# EasyEDA schematic SCH_可乐充电宝_2022-09-24.json
TITLE: Sheet_1; REV: 1.0; Date: 2022-09-20; Sheet: 1/1; Drawn By: big_big_A; Company: Your Company
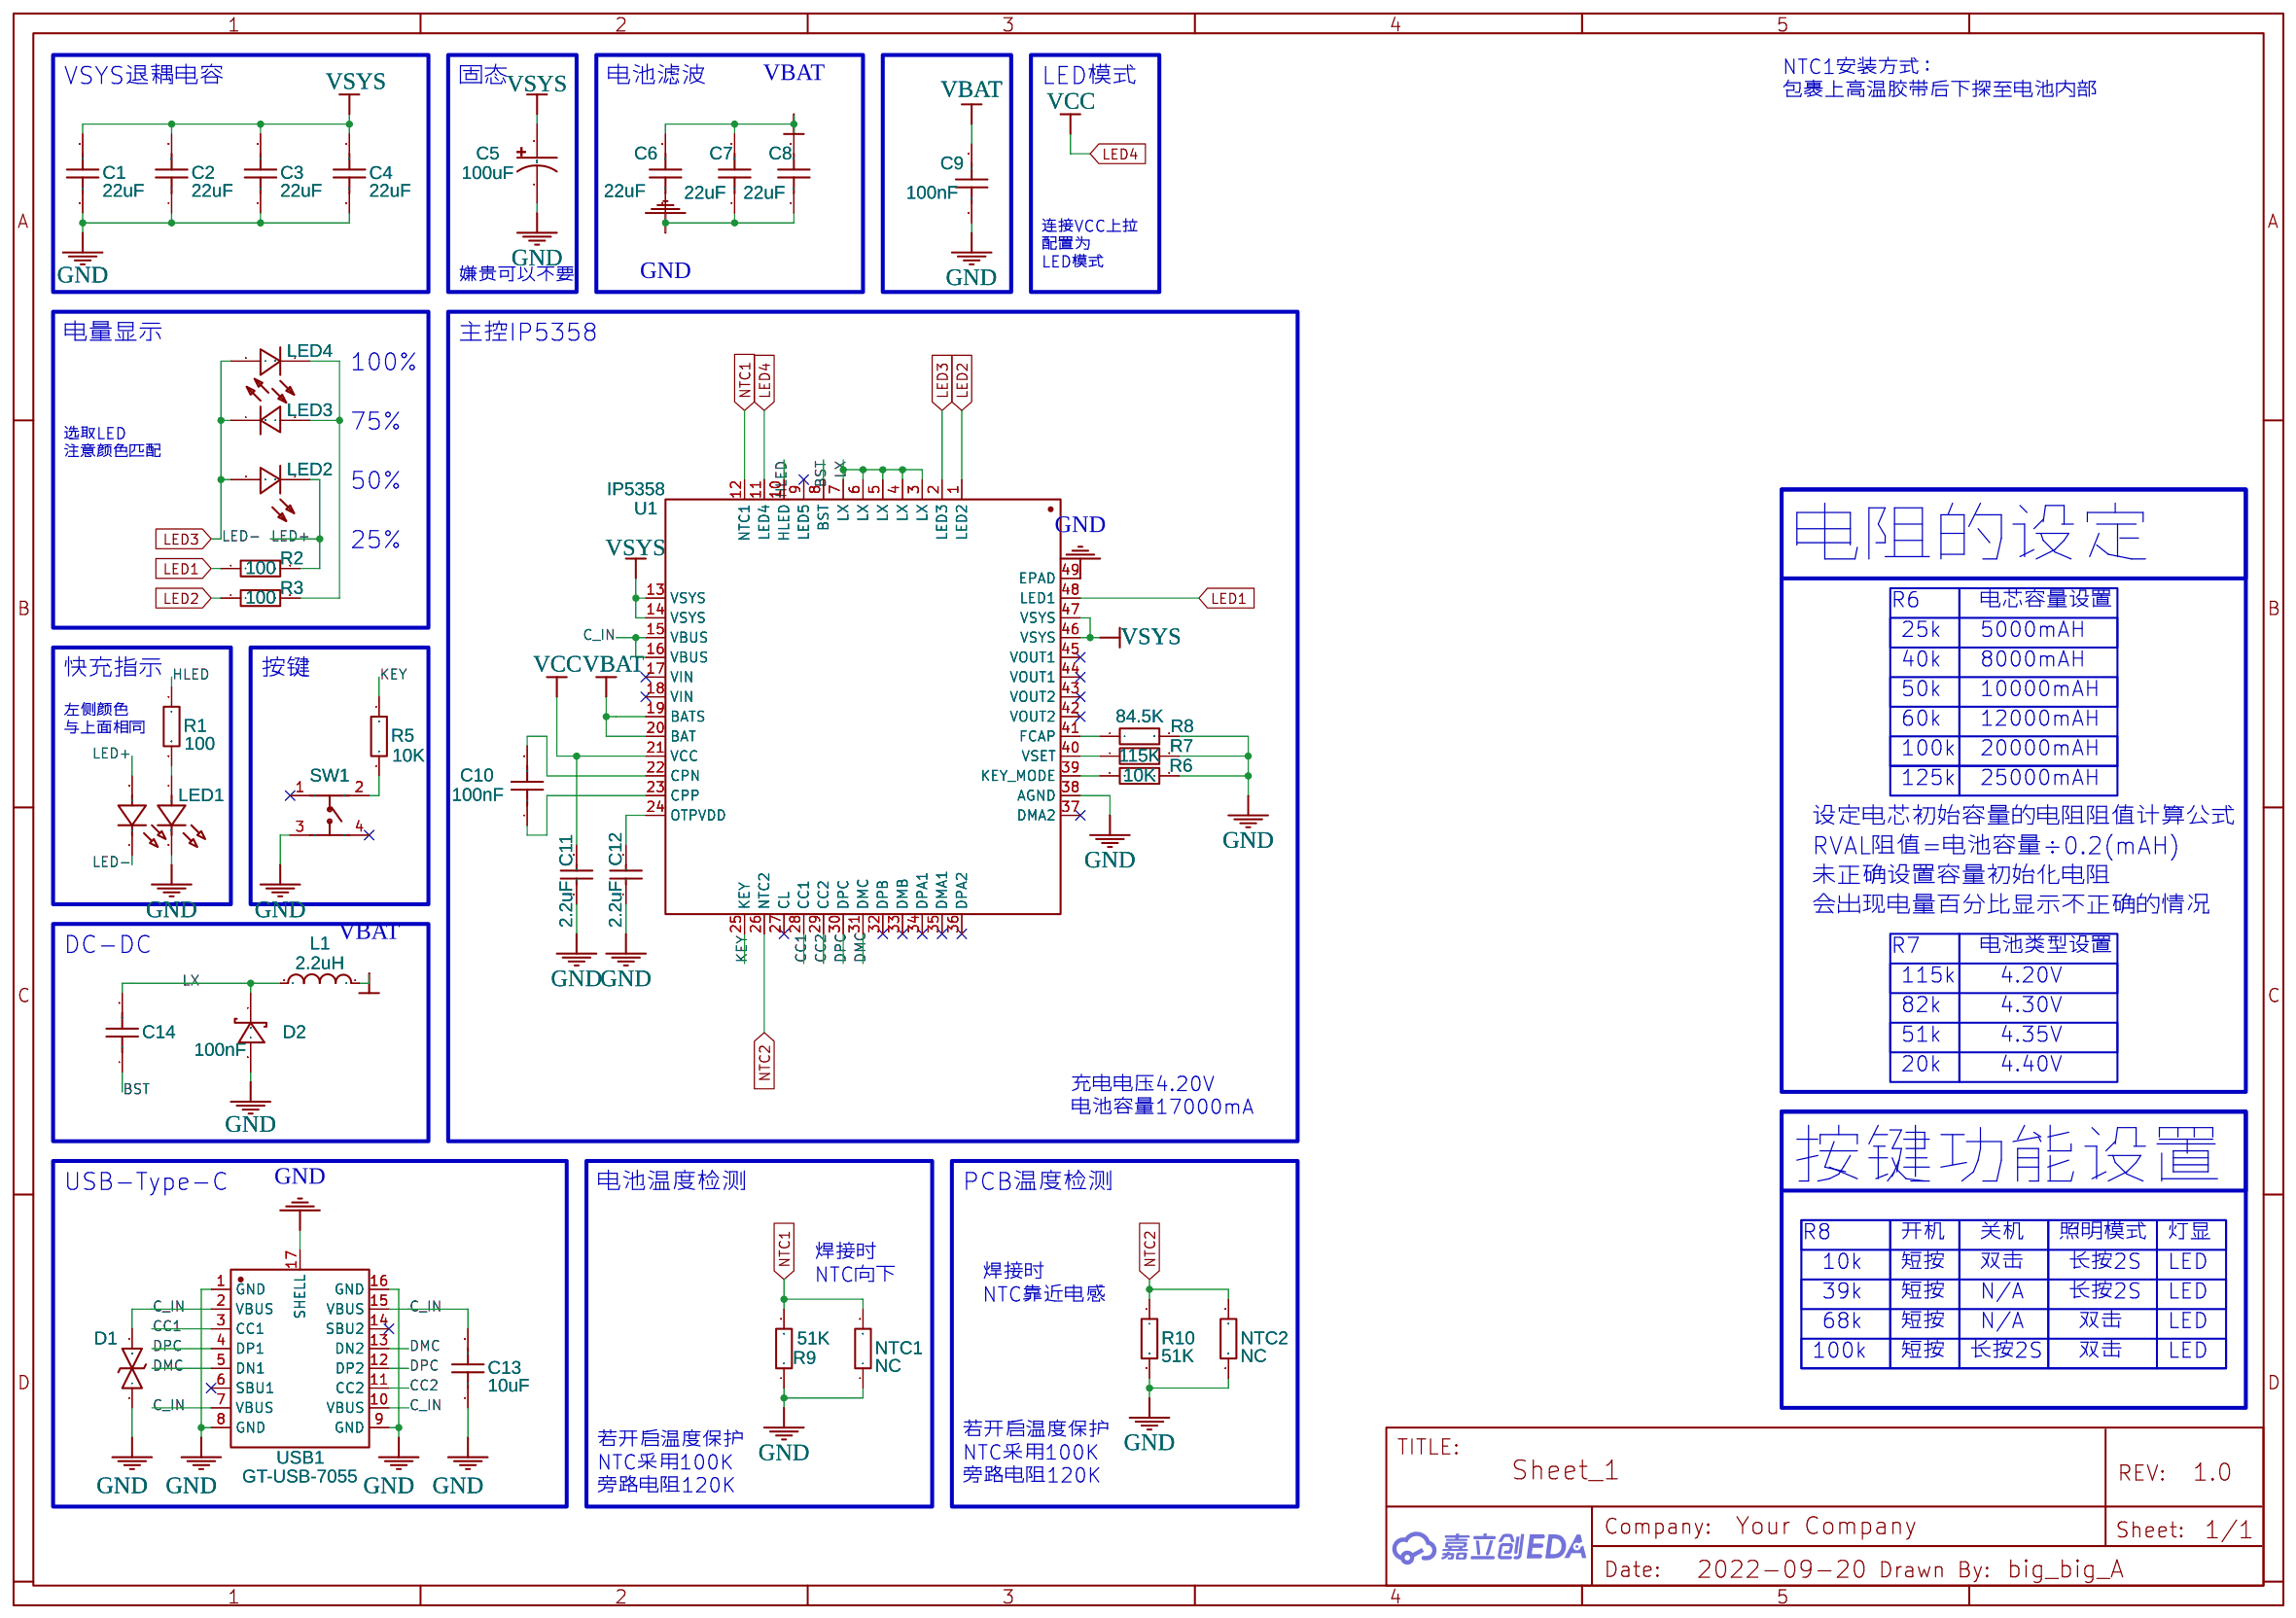
[diagram p0: schematic sheet]

## Parts
C1  22uF  [C1206]
C2  22uF  [C1206]
C3  22uF  [C1206]
C4  22uF  [C1206]
C5  100uF  [CAP-SMD_L7.3-W4.3-FD]
C6  22uF  [C0603]
C7  22uF  [C0603]
C8  22uF  [C0603]
C9  100nF  [C0603]
C10  100nF  [C0603]
C11  2.2uF  [C0603]
C12  2.2uF  [C0603]
C13  10uF  [C0603]
C14  100nF  [C0603]
D1  SMF18CA_C435488  [SOD-123_L2.8-W1.8-LS3.7-BI]
D2  SS34_C408258  [SMA_L4.4-W2.6-LS5.0-RD]
L1  2.2uH  [IND-SMD_L7.1-W6.6]
LED1  红黄绿双色LED  [LED-SMD_4P-L1.6-W1.5-TL_TZ-P4-1615RGTCA1-0.6T]
LED2  BL-HGE37A-AV-TRB  [LED0402-RD]
LED3  BL-HGE37A-AV-TRB  [LED0402-RD]
LED4  BL-HGE37A-AV-TRB  [LED0402-RD]
NTC1  NC  [RES-TH_NTC-100K]
NTC2  NC  [RES-TH_NTC-100K]
R1  100  [R0603]
R2  100  [R0603]
R3  100  [R0603]
R5  10K  [R0603]
R6  10K  [R0603]
R7  115K  [R0603]
R8  84.5K  [R0603]
R9  51K  [R0603]
R10  51K  [R0603]
SW1  TC-1150DR-6.0H-160  [SW-TH_4P-L4.5-W4.5-P3.00-LS5.5]
U1  IP5358  [QFN-48_L7.0-W7.0-P0.50-TL-EP5.4]
USB1  GT-USB-7055  [USB-C-TH_GT-USB-7055]

## Library data of the parts
C1-C4 = EMK316ABJ226KL-T: Supplier: LCSC; Supplier Part: C319197; Manufacturer: Taiyo Yuden; Contributor: LCSC
C5 = SA10JM101A19R55XXX: Supplier: LCSC; Supplier Part: C470943; Manufacturer: AISHI(Aihua Group); Contributor: LCSC; JLCPCB Part Class: Extended Part
C6-C8 = GRM188R61A226ME15D: Supplier: LCSC; Manufacturer: MuRata; Supplier Part: C84419
C9 C10 C14 = CL10B104KB8NNNC: Supplier: LCSC; Manufacturer: SAMSUNG; Supplier Part: C1591
C11 C12 = CC0603KRX5R7BB225: Supplier: LCSC; Manufacturer: YAGEO; Supplier Part: C106853
C13 = GRM188R61E106MA73D: Supplier: LCSC; Manufacturer: MuRata; Supplier Part: C91606
D1 = SMF18CA_C435488: Supplier: LCSC; Supplier Part: C435488; Manufacturer: AnBon; Manufacturer Part: SMF18CA; Contributor: LCSC
D2 = SS34_C408258: Supplier: LCSC; Supplier Part: C408258; Manufacturer: SLKORMICRO Elec.; Manufacturer Part: SS34; Contributor: LCSC
L1 = SLO0624H2R2MTT: Supplier: LCSC; Supplier Part: C216163; Manufacturer: Sunltech Tech; Manufacturer Part: SLO0650H2R2MTT; Contributor: LCSC
LED1 = 红黄绿双色LED: Supplier: LCSC; Supplier Part: C9900023609; Manufacturer: null; JLCPCB Part Class: Extended Part; Contributor: lcsc
LED2-LED4 = BL-HGE37A-AV-TRB: Supplier: LCSC; Supplier Part: C165979; Manufacturer: Bright LED Elec; Contributor: LCSC; JLCPCB Part Class: Extended Part
NTC1 NTC2 = NTC-100K: Supplier: LCSC; Supplier Part: C9900024696; Manufacturer: null; link: https://atta.szlcsc.comnull; JLCPCB Part Class: Extended Part; Contributor: lcsc
R1-R3 R5 = 0603WAF1000T5E: Supplier: LCSC; Manufacturer: UniOhm; LCSC Assembly: Yes; Supplier Part: C22775; SMT Type: Basic
R6 = RMCF0603JT10K0: Supplier: LCSC; Supplier Part: C238881; Manufacturer: Stackpole Elec; Contributor: LCSC
R7 = RC0603FR-07115KL: Supplier: LCSC; Manufacturer: YAGEO; Supplier Part: C137806
R8 = RK73H1JTTD5102F: Supplier: LCSC; Manufacturer: KOA; Contributor: LCSC; Supplier Part: C160049
R9 R10 = 0603WAF5102T5E: Supplier: LCSC; Manufacturer: UniOhm; LCSC Assembly: Yes; Supplier Part: C23196; SMT Type: Basic
SW1 = TC-1150DR-6.0H-160: Supplier: LCSC; Supplier Part: C2905090; Manufacturer: DEALON(德艺隆); Contributor: LCSC
U1 = IP5358: Supplier Part: C879824; Supplier: LCSC; Manufacturer Part: IP5358-BZ; Contributor: Qmery2020_LoveWaiterSeries; Manufacturer: INJOINIC
USB1 = GT-USB-7055: Supplier: LCSC; Supplier Part: C2686963; Manufacturer: G-Switch(品赞); Contributor: LCSC; JLCPCB Part Class: Extended Part

## Nets
GND: C1.1 C2.1 C3.1 C4.2 C5.2 C6.1 C7.1 C8.1 C9.2 C11.1 C12.1 C13.1 D1.1 D2.2(A) LED1.2 NTC1.1 NTC2.1 R6.1 R7.2 R8.2 R9.1 R10.2 SW1.3 U1.38(AGND) U1.49(EPAD) USB1.1(GND) USB1.8(GND) USB1.9(GND) USB1.16(GND) USB1.17(SHELL)
VBAT: C6.2 C7.2 C8.2 C9.1 L1.2 U1.19(BATS) U1.20(BAT)
BST: C14.1 U1.8(BST)
C_IN: C13.2 D1.2 U1.15(VBUS) U1.16(VBUS) USB1.2(VBUS) USB1.7(VBUS) USB1.10(VBUS) USB1.15(VBUS)
CC1: U1.28(CC1) USB1.3(CC1)
CC2: U1.29(CC2) USB1.11(CC2)
DMC: U1.31(DMC) USB1.5(DN1) USB1.13(DN2)
DPC: U1.30(DPC) USB1.4(DP1) USB1.12(DP2)
HLED: R1.1 U1.10(HLED)
KEY: R5.1 U1.25(KEY)
LED1: R2.1 U1.48(LED1)
LED2: R3.1 U1.1(LED2)
LED4: C11.2 U1.11(LED4) U1.21(VCC)
LED+: LED1.3 LED2.1(C) R2.2
LED-: LED1.4 LED2.2(A) LED3.1(C) LED4.2(A) U1.2(LED3)
LX: C14.2 D2.1(C) L1.1 U1.3(LX) U1.4(LX) U1.5(LX) U1.6(LX) U1.7(LX)
NTC1: NTC1.2 R9.2 U1.12(NTC1)
NTC2: NTC2.2 R10.1 U1.26(NTC2)
VSYS: C1.2 C2.2 C3.2 C4.1 C5.1 U1.13(VSYS) U1.14(VSYS) U1.46(VSYS) U1.47(VSYS)
R1_2: LED1.1 R1.2
R3_2: LED3.2(A) LED4.1(C) R3.2
R5_2: R5.2 SW1.2
R6_2: R6.2 U1.39(KEY_MODE)
R8_1: R8.1 U1.41(FCAP)
U1_22: C10.2 U1.22(CPN)
U1_23: C10.1 U1.23(CPP)
U1_24: C12.2 U1.24(OTPVDD)
U1_40: R7.1 U1.40(VSET)

Not connected (* = marked no-connect by the designer): SW1 1* 4*; U1 9(LED5)* 17(VIN)* 18(VIN)* 27(CL)* 32(DPB)* 33(DMB)* 34(DPA1)* 35(DMA1)* 36(DPA2)* 37(DMA2)* 42(VOUT2)* 43(VOUT2)* 44(VOUT1)* 45(VOUT1)*; USB1 6(SBU1)* 14(SBU2)*

## Notes on the sheet
- VSYS退耦电容
- 固态
- 电池滤波
- LED模式
- NTC1安装方式：
  包裹上高温胶带后下探至电池内部
- 连接VCC上拉
  配置为
  LED模式
- 嫌贵可以不要
- 电量显示
- 主控IP5358
- 100%
- 75%
- 选取LED
  注意颜色匹配
- 50%
- 电阻的设定
- 25%
- R6
- 电芯容量设置
- 25k
- 5000mAH
- 40k
- 8000mAH
- 快充指示
- 按键
- 50k
- 10000mAH
- 左侧颜色
  与上面相同
- 60k
- 12000mAH
- 100k
- 20000mAH
- 125k
- 25000mAH
- 设定电芯初始容量的电阻阻值计算公式
- RVAL阻值=电池容量÷0.2(mAH)
- 未正确设置容量初始化电阻
- 会出现电量百分比显示不正确的情况
- DC-DC
- R7
- 电池类型设置
- 115k
- 4.20V
- 82k
- 4.30V
- 51k
- 4.35V
- 20k
- 4.40V
- 充电电压4.20V
  电池容量17000mA
- 按键功能设置
- USB-Type-C
- 电池温度检测
- PCB温度检测
- R8
- 开机
- 关机
- 照明模式
- 灯显
- 焊接时
  NTC向下
- 10k
- 短按
- 双击
- 长按2S
- LED
- 焊接时
  NTC靠近电感
- 39k
- 短按
- N/A
- 长按2S
- LED
- 68k
- 短按
- N/A
- 双击
- LED
- 100k
- 短按
- 长按2S
- 双击
- LED
- 若开启温度保护
  NTC采用100K
  旁路电阻120K
- 若开启温度保护
  NTC采用100K
  旁路电阻120K
